# Altium project 0805,0603,0402,SOD-123,SOD-323.PrjPcb
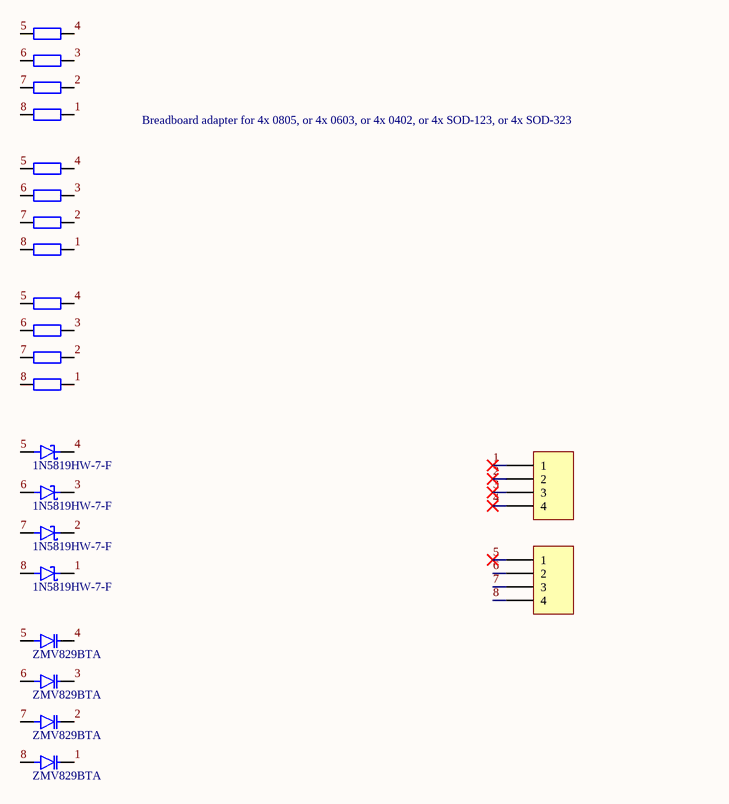
[diagram p0: Schematic.SchDoc]
1 sheet, 22 parts. Net scope: global (net labels, ports and power ports of the same name join across sheets).
Board file: PCB.PcbDoc

## Sheet Schematic.SchDoc
size A4

### Parts
D1  1N5819HW-7-F  [SOD3715X145N]
D2  1N5819HW-7-F  [SOD3715X145N]
D3  1N5819HW-7-F  [SOD3715X145N]
D4  1N5819HW-7-F  [SOD3715X145N]
D5  ZMV829BTA  [SOD2512X116N]
D6  ZMV829BTA  [SOD2512X116N]
D7  ZMV829BTA  [SOD2512X116N]
D8  ZMV829BTA  [SOD2512X116N]
P1  Header 4  [HDR1X4]  (value not drawn)
P2  Header 4  [HDR1X4]  (value not drawn)
R1  (no value)  [0805]
R2  (no value)  [0805]
R3  (no value)  [0805]
R4  (no value)  [0805]
R5  (no value)  [J1-0603]
R6  (no value)  [J1-0603]
R7  (no value)  [J1-0603]
R8  (no value)  [J1-0603]
R9  (no value)  [RES 0402]
R10  (no value)  [RES 0402]
R11  (no value)  [RES 0402]
R12  (no value)  [RES 0402]

### Nets
1: D4.C(K) D8.K P1.1 R4.2 R8.2 R12.2
2: D3.C(K) D7.K P1.2 R3.2 R7.2 R11.2
3: D2.C(K) D6.K P1.3 R2.2 R6.2 R10.2
4: D1.C(K) D5.K P1.4 R1.2 R5.2 R9.2
5: D1.A D5.A P2.1 R1.1 R5.1 R9.1
6: D2.A D6.A P2.2 R2.1 R6.1 R10.1
7: D3.A D7.A P2.3 R3.1 R7.1 R11.1
8: D4.A D8.A P2.4 R4.1 R8.1 R12.1

### Notes on the sheet
- Breadboard adapter for 4x 0805, or 4x 0603, or 4x 0402, or 4x SOD-123, or 4x SOD-323

### Library data of the parts
D1-D4 = 1N5819HW-7-F: Diode Schottky 40 V 1A Surface Mount SOD-123; MF: Diodes Inc.; Value: *; SnapEDA_Link: https://www.snapeda.com/parts/1N5819HW-7-F/Diodes+Inc./view-part/?ref=snap; Purchase-URL: https://pricing.snapeda.com/search/part/1N5819HW-7-F/?ref=eda; Availability: In Stock; Price: None; Package: SOD-123 Fairchild Semiconductor; Check_prices: https://www.snapeda.com/parts/1N5819HW-7-F/Diodes+Inc./view-part/?ref=eda; MP: 1N5819HW-7-F
D5-D8 = ZMV829BTA: Varactors Single 25 V Surface Mount SOD-323; MF: Diodes Inc.; Value: *; SnapEDA_Link: https://www.snapeda.com/parts/ZMV829BTA/Diodes+Inc./view-part/?ref=snap; Purchase-URL: https://pricing.snapeda.com/search/part/ZMV829BTA/?ref=eda; Availability: In Stock; Price: None; Package: SOD-323 Diodes Inc.; Check_prices: https://www.snapeda.com/parts/ZMV829BTA/Diodes+Inc./view-part/?ref=eda; MP: ZMV829BTA
P1 P2 = Header 4: Header, 4-Pin; LatestRevisionDate: 17-Jul-2002; LatestRevisionNote: Re-released for DXP Platform.; Publisher: Altium Limited
R1-R8 = Res 0402: Resistor; Value: *
R9-R12 = Res 0805: Resistor; Value: *